# EAGLE design Breakout DL_IP-M4 rev02 (EAGLE 9.1.3)
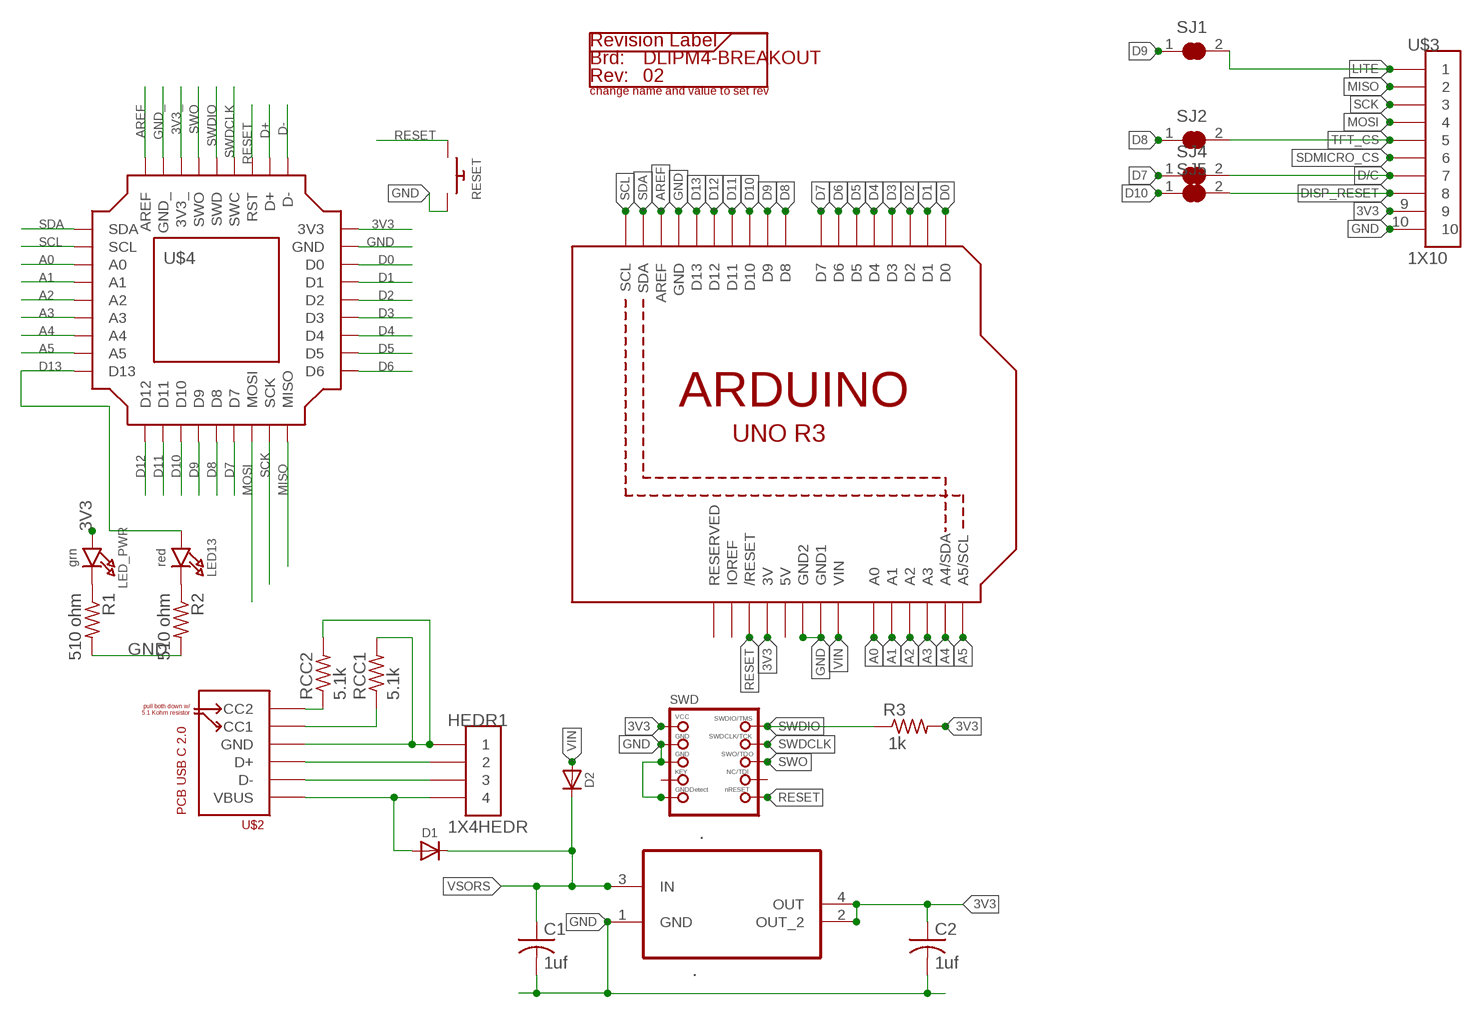
[diagram p0: schematic, sheet 1]

## Parts
.  .  VREG-1.5A-3.3V-LRG  [SOT230P700X180-4N]
C1  1uf  C-TG_0603  [TG-0603]
C2  1uf  C-TG_0603  [TG-0603]
D1  DIODESOD-123  [SOD-123]
D2  DIODESOD-123  [SOD-123]
DLIPM4-BREAKOUT  02  REVISION_LABELLONG  [REVISION_LABEL_LONG]
HEDR1  1X4HEDR  [1X4_HEDR]
LED13  red  LED-MICROBUILDER1206_NOOUTLINE  [MICROBUILDER_CHIPLED_1206_NOOUTLINE]
LED_PWR  grn  LED-MICROBUILDER1206_NOOUTLINE  [MICROBUILDER_CHIPLED_1206_NOOUTLINE]
R1  510 ohm  R_TG_0603  [TG-0603]
R2  510 ohm  R_TG_0603  [TG-0603]
R3  1k  R_TG_0603  [TG-0603]
RCC1  5.1k  R_TG_0603  [TG-0603]
RCC2  5.1k  R_TG_0603  [TG-0603]
RESET  SWITCH_PUSHBUTTONEVQ-PE  [TACT_PANA-EVQ]
SJ1  JUMPER_CLOSEDTEMP  [SOLDERJUMPER_CLOSEDWIRE]
SJ2  JUMPER_CLOSEDTEMP  [SOLDERJUMPER_CLOSEDWIRE]
SJ4  JUMPER_CLOSEDTEMP  [SOLDERJUMPER_CLOSEDWIRE]
SJ5  JUMPER_CLOSEDTEMP  [SOLDERJUMPER_CLOSEDWIRE]
SWD  CON-SWD-JTAG-CORTEXBOXPOSTS  [2X05_1.27MM_BOX_POSTS]
U1  ARDUINOR3-BPLACE  [ARDUINOR3-BPLACE]
U$2  USB-C-PCB-USB-2.0-TYPE-CDS_2  [USB_TYPE_C_DS_2]
U$3  1X10  [1X10_HEDR]
U$4  DATALORE_IP_M4FOOTPRINT  [DL_IP_36-100MIL-FOOTPRINT]

## Nets
3V3: ..2(OUT_2) ..4(OUT) C2.1 LED_PWR.A R3.2 SWD.1(VCC) U1.3V U$3.9 U$4.10(3V3)
3V3_: U$4.3(3V3_)
A0: U1.A0 U$4.34(A0)
A1: U1.A1 U$4.33(A1)
A2: U1.A2 U$4.32(A2)
A3: U1.A3 U$4.31(A3)
A4: U1.A4(A4/SDA) U$4.30(A4)
A5: U1.A5(A5/SCL) U$4.29(A5)
AREF: U1.AREF U$4.1(AREF)
CC1: RCC1.1 U$2.A5(CC1)
CC2: RCC2.1 U$2.B5(CC2)
D0: U1.D0 U$4.12(D0)
D1: U1.D1 U$4.13(D1)
D2: U1.D2 U$4.14(D2)
D3: U1.D3 U$4.15(D3)
D4: U1.D4 U$4.16(D4)
D5: U1.D5 U$4.17(D5)
D6: U1.D6 U$4.18(D6)
D7: SJ4.1 U1.D7 U$4.22(D7)
D8: SJ2.1 U1.D8 U$4.23(D8)
D9: SJ1.1 U1.D9 U$4.24(D9)
D10: SJ5.1 U1.D10 U$4.25(D10)
D11: U1.D11 U$4.26(D11)
D12: U1.D12 U$4.27(D12)
D13: LED13.A U1.D13 U$4.28(D13)
D+: HEDR1.2 U$2.A6(D+) U$2.B6(D+) U$4.8(D+)
D-: HEDR1.3 U$2.A7(D-) U$2.B7(D-) U$4.9(D-)
D/C: SJ4.2 U$3.7
DISP_RESET: SJ5.2 U$3.8
GND: ..1(GND) C1.2 C2.2 HEDR1.1 R1.2 R2.2 RCC1.2 RCC2.2 RESET.P$2 SWD.3(GND) SWD.5(GND) SWD.9(GNDDETECT) U1.GND U1.GND1 U1.GND2 U$2.A1(GND) U$2.A12(GND) U$2.B1(GND) U$2.B12(GND) U$3.10 U$4.11(GND)
GND_: U$4.2(GND_)
LITE: SJ1.2 U$3.1
MISO: U$3.2 U$4.19(MISO)
MOSI: U$3.4 U$4.21(MOSI)
N$4: LED_PWR.C R1.1
N$5: LED13.C R2.1
RESET: RESET.P$1 SWD.10(NRESET) U1.RESET(/RESET) U$4.7(RST)
SCK: U$3.3 U$4.20(SCK)
SCL: U1.SCL U$4.35(SCL)
SDA: U1.SDA U$4.36(SDA)
SDMICRO_CS: U$3.6
SWDCLK: SWD.4(SWDCLK) U$4.6(SWC)
SWDIO: R3.1 SWD.2(SWDIO) U$4.5(SWD)
SWO: SWD.6(SWO) U$4.4(SWO)
TFT_CS: SJ2.2 U$3.5
VBUS: D1.A HEDR1.4 U$2.A4(VBUS) U$2.A9(VBUS) U$2.B4(VBUS) U$2.B9(VBUS)
VIN: D2.A U1.VIN
VSORS: ..3(IN) C1.1 D1.C D2.C
Unconnected: SWD.7(KEY) SWD.8(TDI) U1.IOREF U1.RESERVED

## Power pins joined to a net without a drawn wire
5V: U1.5V

## Library data of the parts
. = 0TG-Lib v01.4:VREG-1.5A-3.3V-LRG: from: snapeda Low Dropout Regulator works with: TLV1117LV33DCYR ADP3339AKCZ-3.3-RL (older ++$); AVAILABILITY: Good; DESCRIPTION: IC REG LINEAR 3.3V 1.5A SOT223-3; MF: Analog Devices; MP: ADP3339AKCZ-3.3-RL; PACKAGE: SOT-223-3 Analog Devices; PRICE: 3.52 USD
C1 C2 = 0TG-Lib v01.4:C-TG
D1 D2 = 0TG-Lib v01.4:DIODE: Diode from: adafruit SMA Model Volts Amps Type Vf Ir Digikey # Notes SSA34-E3 40V 3A Schottky 480mV @ 3A 200uA @ 40V SSA34-E3/61TGITR-ND CDBA120-G 20V 1A Schottky 500mV @ 1A 500uA @ 20V 641-1014-6-ND REEL MBRA210 10V 2A Schottky 350mV @ 2A 700uA @ 10V MBRA210LT3 SOD-123 Model Volts Amps Type Vf Ir Order # Notes BAT54T1G 30V 200mA Schottky 800mV @ 200mA 2uA @ 25V BAT54T1GOSTR-ND B0530W 30V 500mA Schottky 430mV @ 500mA 130uA @ 30V B0530W-FDICT-ND REEL MBR120 20V 1A Schottky 340mV @ 1A MBR120VLSFT1GOSCT-ND SOD-323 Model Volts Amps Type Vf Ir Order # Notes PMEG2005EJ 20V 500mA Schottky 355mV @ 500mA 568-4110-1-ND ZLLS410 10V 570mA Schottky 380mV @ 570mA ZLLS410CT-ND 1N4148WS 75V 150mA Silicon/Simple 1V 1N4148WSFSCT-ND REEL SOD-523 Model Volts Amps Type Vf Ir Order # Notes BAT54XV2 30V 200mA Schottky 0.8V @ 100mA BAT54XV2CT-ND TB751S 30V 30mA Schottky RB751S-40TE61CT-ND SOT23-R/W (R = Solder Paste/Reflow Ovens, W = Hand-Soldering) Model Volts Amps Type Vf Ir Order # Notes BAT54FILM 40V 300mA Schottky 497-7162-1-ND POWERDI-5 Model Volts Amps Type Vf Ir Order # Notes PDS560 60V 5A Schottky 670mV @ 5A 150uA @ 60V PDS560DICT-ND
DLIPM4-BREAKOUT = 0TG-Lib v01.4:REVISION_LABEL
HEDR1 = 0TG-Lib v01.4:1X4
LED13 LED_PWR = 0TG-Lib v01.4:LED-MICROBUILDER: from: microbuilder LED 0603 - 0603 Surface Mount Package 2mA: Green LED - Low Power (3.9mcd, 2ma, 1.7Vf) - Digikey: 475-2709-2-ND Orange LED - Low Power (9.8mcd, 2ma, 1.8Vf) - Digikey: 475-1194-2-ND Red LED - Low Power (5mcd, 2ma, 1.8Vf) - Digikey: 475-1195-2-ND Yellow LED - Low Power (7mcd, 2ma, 1.8Vf) - Digikey: 475-1196-2-ND 5mA: Blue LED - Low Power (17mcd, 5ma, 2.9Vf) - Digikey: LNJ937W8CRACT-ND 0805 - 0805 Surface Mount Package 2mA: Red LED (8.8mcd, 2mA, 1.8Vf, Clear) - Low Power [Digikey: 475-2510-1-ND] Green LED (5mcd, 2mA, 1.8Vf, Clear) - Low Power [Digikey: 475-2730-1-ND] Yellow LED (11.3mcd, 2mA, 1.8Vf, Clear) - Low Power [Digikey: 475-2555-1-ND] 20mA: Red LED (104mcd, 20mA, Diffused) - LS R976 [Digikey: 475-1278-6-ND] Red LED (12mcd, 20mA, 2.0Vf, Clear) - APT2012EC [Digikey: 754-1128-1-ND] Green LED (15mcd, 20mA, 2.2Vf, Clear) - APT2012GC [Digikey: 754-1131-1-ND] Orange LED (160mcd, 20mA, 2.1Vf, Clear) - APT2012SECK [Digikey: 754-1130-1-ND] 1206 - 1206 Surface Mount Package Green LED (26mcd, 20mA, Diffused) - LG N971 [Digikey: 475-1407-6-ND] Red LED (15mcd, 20mA, Diffused) - LH N974 [Digikey: 475-1416-6-ND] Cree - Cree High-Power Surface Mount LEDs XPEBWT-L1-0000-00D50 - White 111lm 350mA 2.9Vf 6200K 110° XTEAWT-00-0000-00000LEE3 - White 114lm 350mA 2.85Vf 5000K 115° Everlight - Everlight 45-21 Series Surface Mount LEDs 45-21/QK2C-B2832AC2CB2/2T - Warm White 2000mcd 20mA 3.25Vf 3050K 120° 45-21/LK2C-B38452C4CB2/2T - Nuetral White 2000mcd 20mA 3.25Vf 4150K 120° 45-21/LK2C-B50634C6CB2/2T - Cold White 2200mcd 20mA 3.25Vf 5650K 120° PLCC2 Reverse Mount LS T77K-J1L2-1-0-2-R18-Z - Red 11.25mcd 2mA 1.8Vf 630nm 120° LO T77K-L1M2-24-Z - Orange 19.6mcd 2mA 1.8Vf 606nm 120° LY T77K-K2M1-26-Z - Yellow 15.7mcd 2mA 1.8Vf 587nm 120°
R1-R3 RCC1 RCC2 = 0TG-Lib v01.4:R_TG
RESET = 00adafruit:SWITCH_PUSHBUTTON: Buttons SOFTTOUCHSMD_SJ - Soft touch temporary push button (Super Junk Akihabara) Compatible with SKPMANE010 [Mouser: 688-SKPMAN] C&K_KSS = Digikey: KSS221GLFS
SJ1 SJ2 SJ4 SJ5 = 0TG-Lib v01.4:JUMPER_CLOSED: Solder Jumper - Closed from: microbuilder These solder jumpers are closed by default CLOSEDWIRE - 10 mil trace between pads that can be cut and resoldered later CLOSEDPERM - 63 mil trace between pads for a permanent connection (used to 'bridge' two signals, a shameless hack for Eagle). Can double as a test point as well (no cream layer)
SWD = 0TG-Lib v01.4:CON-SWD-JTAG-CORTEX: from: adafruit Serial Wire (SW-DP) Connector Standard 0.05" 10-pin connector is for use with the Cortex M and Cortex A SWD (serial wire debugger) interface (SW-DP) Connectors 2x05_1.27MM_SMT - Inexpensive surface-mount header with bare pins, compatible with standard 10-pin SWD cables (4UCON: 16846) 2x05_1.27MM_BOX_NOPOSTS - Polarised surface-mount box (4UCON with caps: 19735, without caps: 15117 2x05_1.27MM_BOX_POSTS - Polarised surface-mount box with mounting holes (4UCON: 20317) Pinout: http://infocenter.arm.com/help/topic/com.arm.doc.faqs/attached/13634/cortex_debug_connectors.pdf http://www.keil.com/peripherals/coresight/connectors.asp
U1 = 00adafruit:ARDUINOR3: This is a new object for the new Arduino R3 - with extra pins that you may want to use (such as IOref, and duplicated A4/A5
U$2 = 0TG-Lib v01.4:USB-C-PCB-USB-2.0-TYPE-C: from: Pinuct on github, modified by: TG-Techie
U$3 = 0TG-Lib v01.4:1X10
U$4 = 0TG-Lib v01.4:DATALORE_IP_M4

## Board
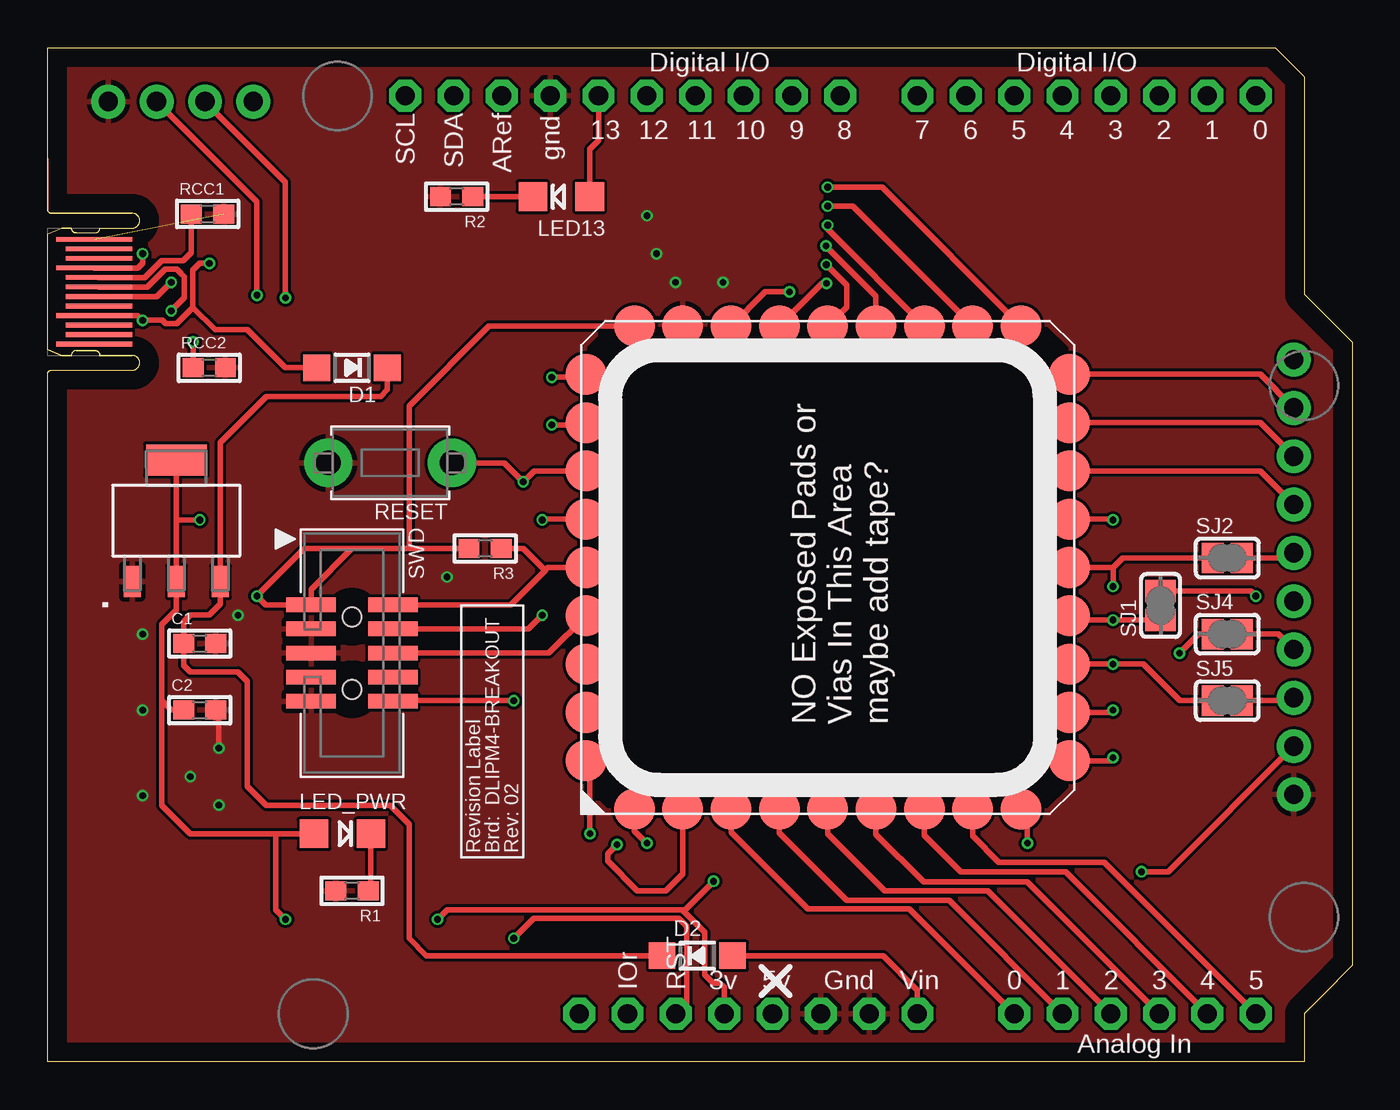
[diagram p1: board, top side]
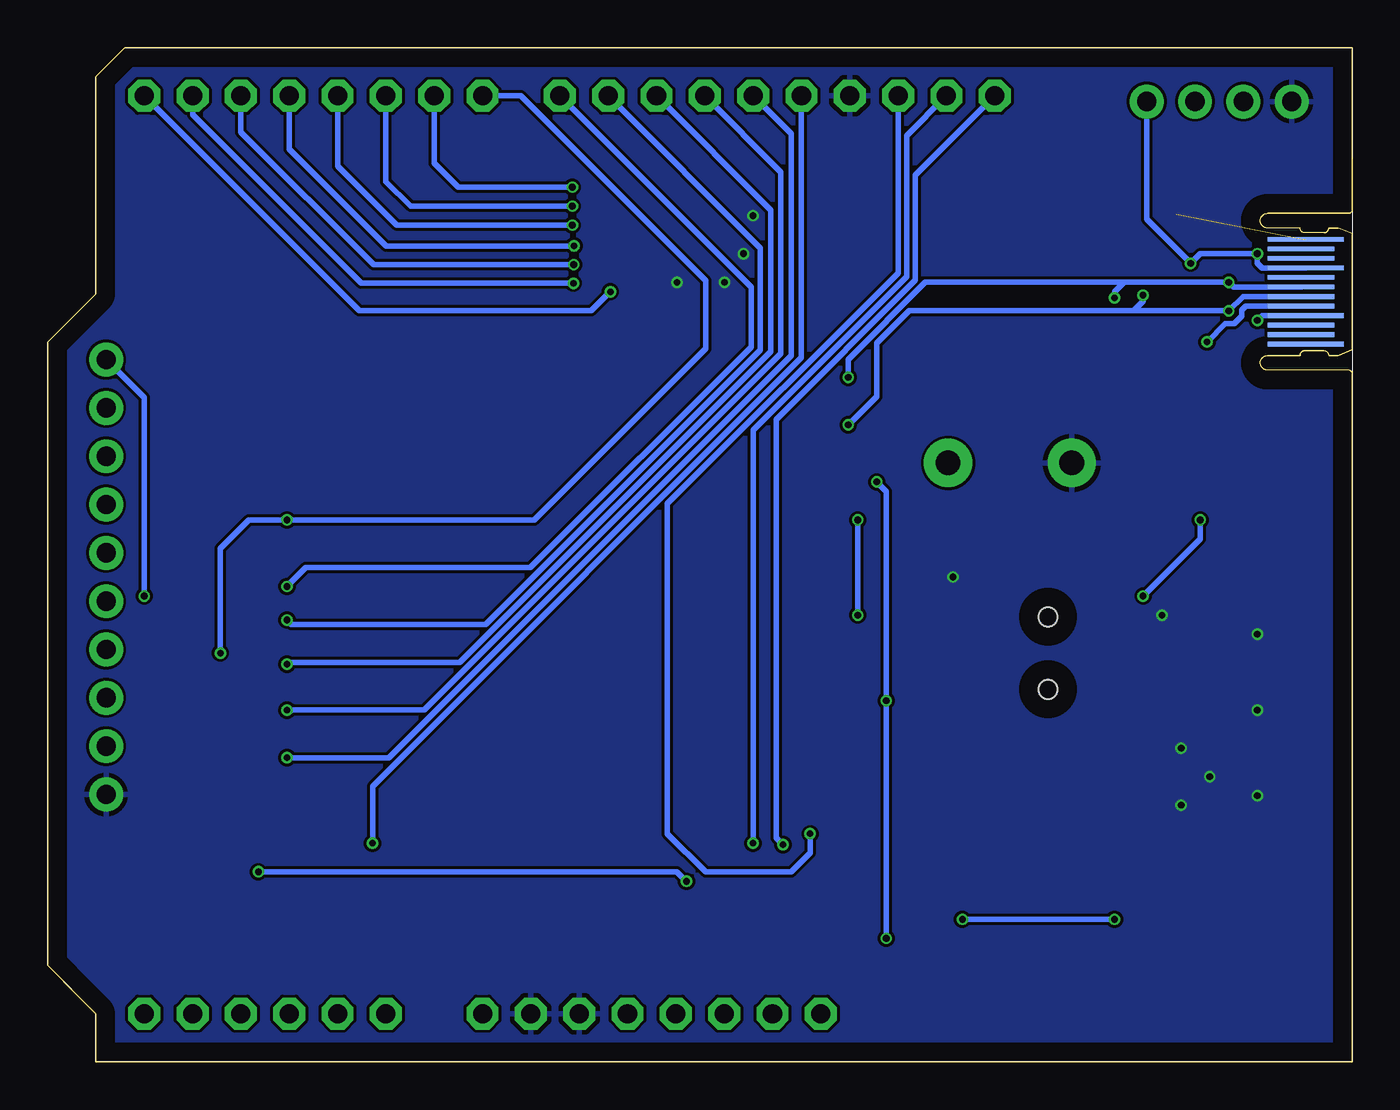
[diagram p2: board, bottom side, seen from below]

Size 68.58 x 53.34 mm. Coordinates in mm from the lower left corner, seen from the top.
Outline: 0,53.34 64.52,53.34 66,51.85 66.04,51.81 66.04,51.66 66.04,40.38 67.11,39.31 68.58,37.84 68.58,36.6 68.58,5.08 66.94,3.44 66.04,2.54 66.04,1.91 66.04,0 0,0 0,33.49 0,36.17 arc-90 0.2,36.38 4.45,36.38 arc90 4.84,36.77 arc90 4.45,37.16 3.63,37.16 2.75,37.16 arc90 2.5,37.41 2.04,37.41 1.5,37.41 arc90 1.25,37.16 0.75,37.16 0,37.45 0,43.55 0.75,43.84 1.25,43.84 arc90 1.5,43.59 1.89,43.59 2.5,43.59 arc90 2.75,43.84 4.45,43.84 arc90 4.84,44.23 arc90 4.45,44.62 3.1,44.62 0.2,44.62 arc-90 0,44.83 0,53.34
Copper layers (1*16): Top 0.035mm / dielectric 0.53mm / Bottom 0.035mm
Design rules "tg jlc-special via": minimum track width 0.195mm, minimum drill 0.2mm, track to track 6mil, track to pad 6mil, pad to pad 6mil, via to via 6mil, smd to smd 6mil, copper to edge 40mil, drill to drill 6mil, minimum pad ring 10mil, minimum via ring 0.125mm, stop-mask expansion 4mil, vias tented up to drill 10000mil, thermal gap 10mil
tRestrict: area 28.5,13.5 to 53.5,38.5

### Footprints (pad centres in the part's own frame; a part is rotated, then mirrored left to right if it is on the bottom)
SOT230P700X180-4N = smd 1.626 x 0.889: 1 -3.2,2.311; 2 -3.2,0; 3 -3.2,-2.311 | smd 1.626 x 3.175: 4 3.2,0
TG-0603 = smd 1.1 x 1: 1 -0.85,0; 2 0.85,0
SOD-123 = smd 1.4 x 1.4: A 1.85,0; C -1.85,0
1X4_HEDR = drill 1.016 pad 1.778: 1 -3.81,0; 2 -1.27,0; 3 1.27,0; 4 3.81,0
MICROBUILDER_CHIPLED_1206_NOOUTLINE = smd 1.5 x 1.5: A 0,-1.496; C 0,1.496
TACT_PANA-EVQ = drill 1.3 pad 2.54: P$1 -3.25,0; P$2 3.25,0
SOLDERJUMPER_CLOSEDWIRE = smd 1.168 x 1.6: 1 -0.762,0; 2 0.762,0 | smd 0.635 x 0.203: WIRE 0,0
2X05_1.27MM_BOX_POSTS = smd 0.76 x 2.6: 1 -2.54,-2.15; 2 -2.54,2.15; 3 -1.27,-2.15; 4 -1.27,2.15; 5 0,-2.15; 6 0,2.15; 7 1.27,-2.15; 8 1.27,2.15; 9 2.54,-2.15; 10 2.54,2.15 | hole 1: -1.905,0; 1.905,0
ARDUINOR3-BPLACE = drill 1 pad 1.676 octagon: 3V 35.56,2.54; 5V 38.1,2.54; A0 50.8,2.54; A1 53.34,2.54; A2 55.88,2.54; A3 58.42,2.54; A4 60.96,2.54; A5 63.5,2.54; AREF 23.876,50.8; D0 63.5,50.8; D1 60.96,50.8; D2 58.42,50.8; D3 55.88,50.8; D4 53.34,50.8; D5 50.8,50.8; D6 48.26,50.8; D7 45.72,50.8; D8 41.656,50.8; D9 39.116,50.8; D10 36.576,50.8; D11 34.036,50.8; D12 31.496,50.8; D13 28.956,50.8; GND 26.416,50.8; GND1 43.18,2.54; GND2 40.64,2.54; IOREF 30.48,2.54; RESERVED 27.94,2.54; RESET 33.02,2.54; SCL 18.796,50.8; SDA 21.336,50.8; VIN 45.72,2.54
USB_TYPE_C_DS_2 = smd 0.25 x 4: A1 2.75,-2.45; A4 1.25,-2.45; A9 -1.25,-2.45; A12 -2.75,-2.45 | smd 0.25 x 3.5: A2 2.25,-2.7; A3 1.75,-2.7; A5 0.75,-2.7; A6 0.25,-2.7; A7 -0.25,-2.7; A8 -0.75,-2.7; A10 -1.75,-2.7; A11 -2.25,-2.7 | smd 0.25 x 4 bottom: B1 -2.75,-2.45; B4 -1.25,-2.45; B9 1.25,-2.45; B12 2.75,-2.45 | smd 0.25 x 3.5 bottom: B2 -2.25,-2.7; B3 -1.75,-2.7; B5 -0.75,-2.7; B6 -0.25,-2.7; B7 0.25,-2.7; B8 0.75,-2.7; B10 1.75,-2.7; B11 2.25,-2.7
1X10_HEDR = drill 1.016 pad 1.778: 1 -11.43,0; 2 -8.89,0; 3 -6.35,0; 4 -3.81,0; 5 -1.27,0; 6 1.27,0; 7 3.81,0; 8 6.35,0; 9 8.89,0; 10 11.43,0
DL_IP_36-100MIL-FOOTPRINT = smd 2.159 x 2.159: 1 -10.16,12.7; 2 -7.62,12.7; 3 -5.08,12.7; 4 -2.54,12.7; 5 0,12.7; 6 2.54,12.7; 7 5.08,12.7; 8 7.62,12.7; 9 10.16,12.7; 10 12.7,10.16; 11 12.7,7.62; 12 12.7,5.08; 13 12.7,2.54; 14 12.7,0; 15 12.7,-2.54; 16 12.7,-5.08; 17 12.7,-7.62; 18 12.7,-10.16; 19 10.16,-12.7; 20 7.62,-12.7; 21 5.08,-12.7; 22 2.54,-12.7; 23 0,-12.7; 24 -2.54,-12.7; 25 -5.08,-12.7; 26 -7.62,-12.7; 27 -10.16,-12.7; 28 -12.7,-10.16; 29 -12.7,-7.62; 30 -12.7,-5.08; 31 -12.7,-2.54; 32 -12.7,0; 33 -12.7,2.54; 34 -12.7,5.08; 35 -12.7,7.62; 36 -12.7,10.16

### Placement (x,y rotation side)
.  6.77,28.46 90 top
C1  8,22 0 top
C2  8,18.5 0 top
D1  16,36.5 180 top
D2  34.15,5.59 0 top
DLIPM4-BREAKOUT  22,11 90 top
HEDR1  7,50.5 0 top
LED13  27,45.5 90 top
LED_PWR  15.5,12 270 top
R1  16,9 180 top
R2  21.5,45.5 180 top
R3  23,27 180 top
RCC1  8.41,44.59 0 top
RCC2  8.5,36.5 0 top
RESET  18,31.5 180 top
SJ1  58.5,24 90 top
SJ2  62,26.5 0 top
SJ4  62,22.5 0 top
SJ5  62,19 0 top
SWD  16,21.5 270 top
U1  0,0 0 top
U$2  0,40.5 90 top
U$3  65.5,25.5 270 top
U$4  41,26 90 top

### Tracks (layer width: path | path; a pad name or v marks a point on that pad's centre or on a via)
3V3  (via drill 0.35)
  Top 0.3: 16,27 19,27 | 19,27 R3.2 | 16,27 13.85,24.85 SWD.1 11.46,24.04 v11,24.5 13.5,27 16,27 | 6.77,28.5 ..2 6.77,23.77 6,23 6,19 | 6.77,28.5 ..4 | U1.3V 35.56,3.94 35.37,4.13 34.99,4.13 34.55,4.58 34.55,6.82 33.43,7.93 | 6,19 6.5,18.5 C2.1 | 6,19 6,13.5 7.5,12 12,12 | 12,12 LED_PWR.A | 33.43,7.93 33.36,8 21,8 v20.5,7.5 | v8,28.5 6.77,28.5 | v12.5,7.5 12,8 12,12 | U$3.9 58.89,10 v57.5,10 | v35,9.5 33.43,7.93 | 19,27 19,34.5 23.2,38.7 U$4.10
  Bottom 0.3: v11,24.5 8,27.5 v8,28.5 | v20.5,7.5 v12.5,7.5 | v57.5,10 35.5,10 v35,9.5
A0
  Top 0.3: U1.A0 45.29,8.05 39.95,8.05 35.92,12.08 U$4.34
A1
  Top 0.3: U$4.33 38.46,12.04 42,8.5 47.38,8.5 U1.A1
A2
  Top 0.3: U1.A2 49.41,9.01 46.51,9.01 46.5,9 44,9 41,12 U$4.32
A3
  Top 0.3: U1.A3 51.5,9.46 46.04,9.46 43.54,11.96 U$4.31
A4
  Top 0.3: U1.A4 53.5,10 48,10 46.08,11.92 U$4.30
A5
  Top 0.3: U1.A5 55.54,10.5 50,10.5 48.62,11.88 U$4.29
AREF  (via drill 0.35)
  Top 0.3: U$4.1 28.5,15.64 v28.5,12
  Bottom 0.3: U1.AREF 23.88,41.48 36,29.36 36,12 34,10 29.5,10 28.5,11 v28.5,12
CC1
  Top 0.3: U$2.A5 5.11,41.25 5.99,42.13 7.13,42.13 7.56,42.56 RCC1.1
CC2  (via drill 0.35)
  Top 0.3: RCC2.1 v7.65,37.85 v7.64,37.86
  Bottom 0.3: U$2.B5 5.61,39.75 5.82,39.54 5.82,39.22 6.22,38.82 6.68,38.82 v7.64,37.86
D0  (via drill 0.35)
  Top 0.3: U$4.12 37.72,40.5 v39,40.5
  Bottom 0.3: v39,40.5 40,39.5 52.2,39.5 U1.D0
D1  (via drill 0.35)
  Top 0.3: U$4.13 40.71,40.95 v40.95,40.95
  Bottom 0.3: v40.95,40.95 52.11,40.95 60.96,49.8 U1.D1
D2  (via drill 0.35)
  Top 0.3: U$4.14 42,39.7 42,40.85 v40.93,41.93
  Bottom 0.3: v40.93,41.93 51.45,41.93 58.42,48.9 U1.D2
D3  (via drill 0.35)
  Top 0.3: U$4.15 43.54,40.28 v40.91,42.91
  Bottom 0.3: U1.D3 55.88,48 50.79,42.91 v40.91,42.91
D4  (via drill 0.35)
  Top 0.3: U$4.16 41,43.78 v41,44
  Bottom 0.3: v41,44 50.24,44 53.34,47.1 U1.D4
D5  (via drill 0.35)
  Top 0.3: U$4.17 42.32,45 v41,45
  Bottom 0.3: U1.D5 50.8,46.3 49.5,45 v41,45
D6  (via drill 0.35)
  Top 0.3: U$4.18 43.86,46 v41,46
  Bottom 0.3: v41,46 47,46 48.26,47.26 U1.D6
D7  (via drill 0.35)
  Top 0.3: U$4.22 55.96,28.54 v56,28.5 | SJ4.1 60.5,22.5 v59.5,21.5
  Bottom 0.3: v59.5,21.5 59.5,27 58,28.5 v56,28.5 43,28.5 34,37.5 34,41.08 43.72,50.8 U1.D7
D8  (via drill 0.35)
  Top 0.3: U$4.23 56,26 | 56,26 56.5,26.5 SJ2.1 | 56,26 v56,25
  Bottom 0.3: v56,25 55,26 43.2,26 31.6,37.6 31.6,40.74 U1.D8
D9  (via drill 0.35)
  Top 0.3: SJ1.1 v56,23.24 53.92,23.24 U$4.24
  Bottom 0.3: v56,23.24 55.76,23 45.56,23 31.12,37.44 31.12,42.8 U1.D9
D10  (via drill 0.35)
  Top 0.3: SJ5.1 59.5,19 57.58,20.92 v56,20.92 U$4.25
  Bottom 0.3: v56,20.92 55.92,21 46.92,21 30.58,37.34 30.58,44.8 U1.D10
D11  (via drill 0.35)
  Top 0.3: U$4.26 55.88,18.38 v56,18.5
  Bottom 0.3: v56,18.5 48.78,18.5 30.04,37.24 30.04,46.8 U1.D11
D12  (via drill 0.35)
  Top 0.3: U$4.27 55.84,15.84 v56,16
  Bottom 0.3: U1.D12 29.5,48.8 29.5,37.14 50.64,16 v56,16
D13  (via drill 0.35)
  Top 0.3: v51.5,11.5 51.5,12.96 U$4.28 | U1.D13 28.96,48.46 28.5,48 LED13.A
  Bottom 0.3: U1.D13 28.96,37.04 51.5,14.5 v51.5,11.5
D+  (via drill 0.35)
  Top 0.3: U$2.A6 5.25,40.75 6.18,41.68 6.78,41.68 6.96,41.5 7,41.5 7,41.46 7.18,41.28 7.18,40.18 v6.5,39.5 | U$4.8 28.18,33.5 v26.5,33.5 | HEDR1.2 11,45.23 v11,40.32
  Bottom 0.3: U$2.B6 5.75,40.25 v6.5,39.5 11.5,39.5 | v26.5,33.5 25,35 25,37.8 23.3,39.5 11.5,39.5 | 11.5,39.5 11,40 v11,40.32
D-  (via drill 0.35)
  Top 0.3: U$2.A7 5.75,40.25 v6.5,41 | v12.5,40.18 12.5,46.27 HEDR1.3 | U$4.9 28.14,36 v26.5,36
  Bottom 0.3: U$2.B7 6.25,40.75 v6.5,41 12,41 | 12,41 22.44,41 26.5,36.94 v26.5,36 | 12,41 12.5,40.5 v12.5,40.18
D/C
  Top 0.3: SJ4.2 64.69,22.5 U$3.7
DISP_RESET
  Top 0.3: SJ5.2 65.35,19 U$3.8
GND  (via drill 0.35)  (1 unrouted)
  Top 0.3: C2.2 9,18.35 v9,16.5
  other vias: 33,41 32,42.5 31.5,44.5 35.5,41 21,25.5 7.5,15 9,13.5 10,23.5 5,22.5 5,14 5,18.5
  pour Bottom: -0.5,54 -0.5,-0.5 72,-0.5 72,54
  pour Top: -1,54.5 -1,-1 72.5,-1 72.5,54.5
LITE  (via drill 0.35)
  Top 0.3: SJ1.2 63.24,24.76 v63.5,24.5
  Bottom 0.3: U$3.1 63.5,34.93 v63.5,24.5
MISO
  Top 0.3: U$4.19 63.73,36.16 U$3.2
MOSI
  Top 0.3: U$4.21 63.73,31.08 U$3.4
N$4
  Top 0.3: LED_PWR.C 17,9.15 R1.1
N$5
  Top 0.3: R2.1 LED13.C
RESET  (via drill 0.35, 0.35 pad 0.12)
  Top 0.3: RESET.P$1 24,31.5 v25,30.5 25.58,31.08 U$4.7 | U1.RESET 33.59,3.11 33.59,7.13 33.17,7.55 25.55,7.55 v24.5,6.5 | v24.5,19 18.19,19 SWD.10
  Bottom 0.3: v25,30.5 24.5,30 v24.5,19 v24.5,6.5
SCK
  Top 0.3: U$3.3 63.73,33.62 U$4.20
SCL  (via drill 0.35)
  Top 0.3: v29.93,11.43 29.43,10.93 29.43,10.57 31,9 32.5,9 33.38,9.88 U$4.35
  Bottom 0.3: U1.SCL 22.97,46.62 22.97,41.11 30.29,33.79 30.29,11.79 v29.93,11.43
SDA  (via drill 0.35)
  Top 0.3: U$4.36 30.84,12.16 v31.5,11.5
  Bottom 0.3: v31.5,11.5 31.5,33.22 23.42,41.3 23.42,48.71 U1.SDA
SWDCLK  (via drill 0.35)
  Top 0.3: SWD.4 25.27,22.77 v26,23.5 | v26,28.5 26.04,28.54 U$4.6
  Bottom 0.3: v26,23.5 v26,28.5
SWDIO
  Top 0.3: 26.15,25.85 26.3,26 U$4.5 | 26.15,25.85 24.34,24.04 SWD.2 | 26.15,25.85 25,27 R3.1
SWO
  Top 0.3: U$4.4 26.34,21.5 SWD.6
TFT_CS
  Top 0.3: U$3.5 65.23,26.5 SJ2.2
VBUS  (via drill 0.35)
  Top 0.3: v8.5,42 8,42 7.63,41.63 7.63,39.67 | 7.63,39.67 6.78,38.82 6.22,38.82 6.04,39 v5,39 4.75,39.25 U$2.B4 | v5,42.5 5,42 4.75,41.75 U$2.B9 | 7.63,39.67 8.8,38.5 10.5,38.5 12.5,36.5 D1.A
  Bottom 0.3: U$2.B4 4.75,39.25 v5,39 | U$2.B9 4.75,41.75 5,42 v5,42.5 8,42.5 v8.5,42 10.81,44.31 HEDR1.4
VIN
  Top 0.3: U1.VIN 45.72,3.78 43.91,5.59 D2.A
VSORS
  Top 0.3: D1.C 17.85,35.35 17.5,35 11.5,35 9.08,32.58 ..3 9.08,24.08 8.5,23.5 7.5,23.5 7.15,23.15 C1.1 7.15,20.85 7.5,20.5 10,20.5 10.5,20 10.5,14.5 11.5,13.5 18,13.5 19,12.5 19,6.5 19.91,5.59 D2.C